# Altium project DISPLAY_EUA.PrjPcb
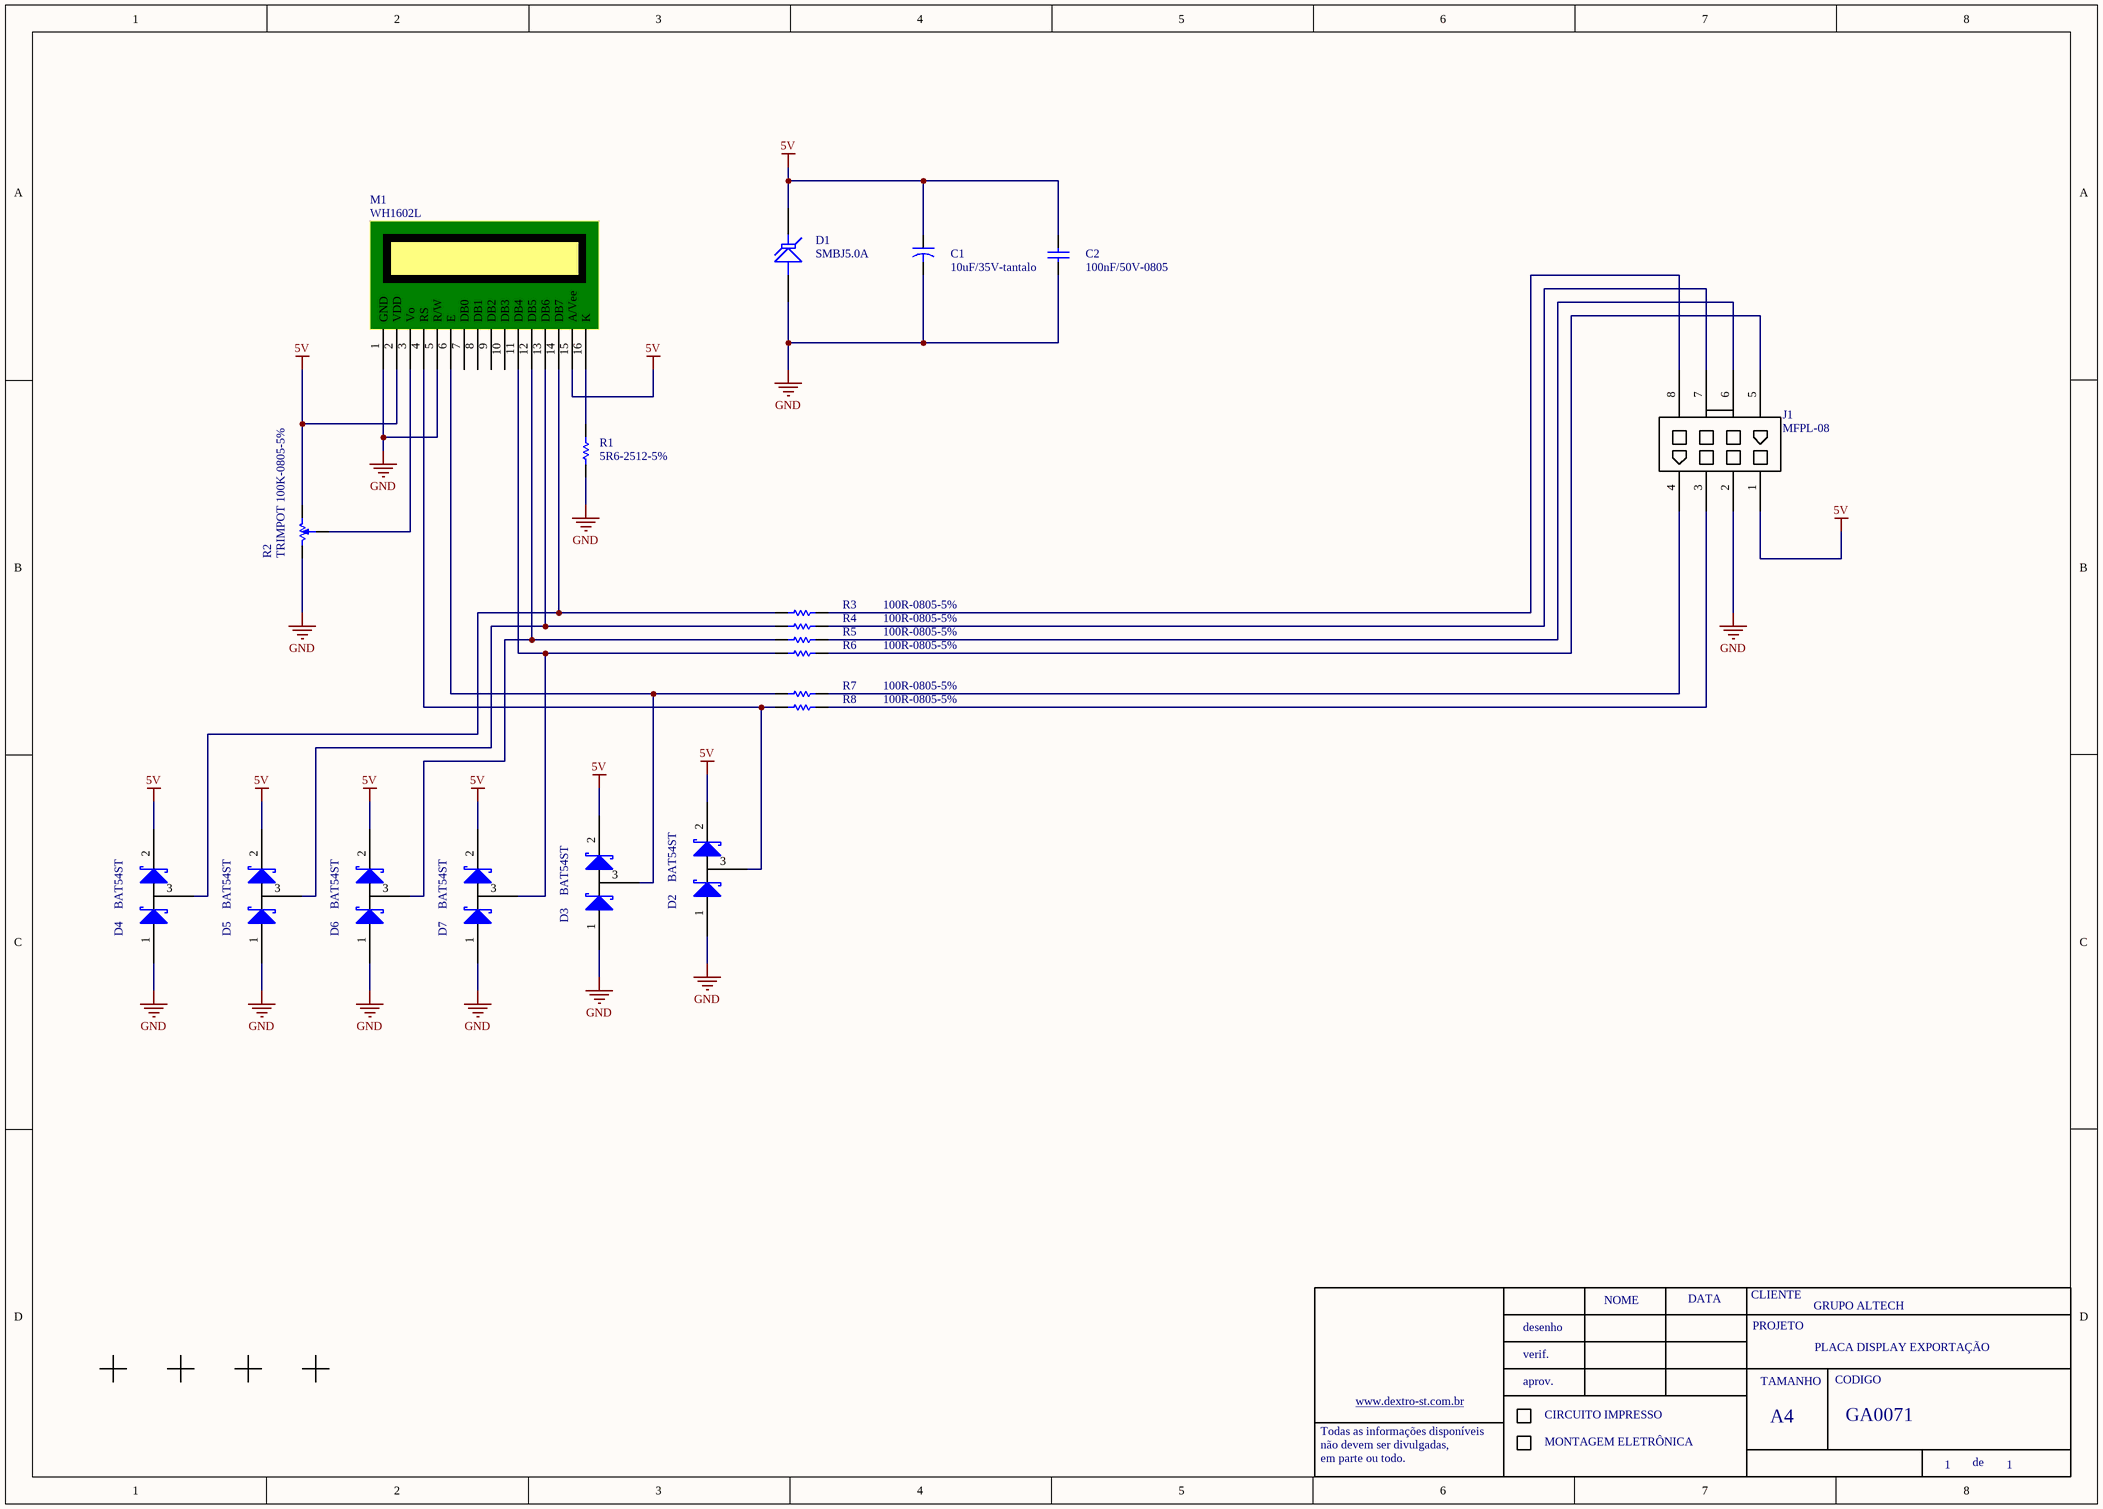
[diagram p0: Display_EUA.SchDoc]
1 sheet, 23 parts. Net scope: global (net labels, ports and power ports of the same name join across sheets).
Board files: DISPLAY_CE.PcbDoc, Painel_GA0071.PcbDoc

## Sheet Display_EUA.SchDoc: GRUPO ALTECH
size A3; DocumentNumber: GA0071; SheetNumber: 1; SheetTotal: 1

### Parts
C1  10uF/35V-tantalo  [tantalo vishay E]
C2  100nF/50V-0805  [0805-REVISADO ONDA]
D1  SMBJ5.0A  [DO-214AA]
D2  BAT54ST  [SOT23 - REVISADO ONDA]
D3  BAT54ST  [SOT23 - REVISADO ONDA]
D4  BAT54ST  [SOT23 - REVISADO ONDA]
D5  BAT54ST  [SOT23 - REVISADO ONDA]
D6  BAT54ST  [SOT23 - REVISADO ONDA]
D7  BAT54ST  [SOT23 - REVISADO ONDA]
FD1  FID  [FIDUCIAL CRUZ]  (value not drawn)
FD2  FID  [FIDUCIAL CRUZ]  (value not drawn)
FD3  FID  [FIDUCIAL CRUZ]  (value not drawn)
FD4  FID  [FIDUCIAL CRUZ]  (value not drawn)
J1  MFPL-08  [MFPC-08]
M1  WH1602L  [WH1602L1]
R1  5R6-2512-5%  [2512 - REVISADO ONDA]
R2  TRIMPOT 100K-0805-5%  [trimmer 3386]
R3  100R-0805-5%  [0805-REVISADO ONDA]
R4  100R-0805-5%  [0805-REVISADO ONDA]
R5  100R-0805-5%  [0805-REVISADO ONDA]
R6  100R-0805-5%  [0805-REVISADO ONDA]
R7  100R-0805-5%  [0805-REVISADO ONDA]
R8  100R-0805-5%  [0805-REVISADO ONDA]

### Nets
5V: C1.1 C2.2 D1.2(K) D2.2 D3.2 D4.2 D5.2 D6.2 D7.2 J1.1 M1.2(VDD) M1.15(A/Vee) R2.3
GND: C1.2 C2.1 D1.1(A) D2.1 D3.1 D4.1 D5.1 D6.1 D7.1 J1.2 M1.1(GND) M1.5(R/W) R1.1 R2.1
NetD2_3: D2.3 M1.4(RS) R8.1
NetD3_3: D3.3 M1.6(E) R7.1
NetD4_3: D4.3 M1.14(DB7) R3.1
NetD5_3: D5.3 M1.13(DB6) R4.1
NetD6_3: D6.3 M1.12(DB5) R5.1
NetD7_3: D7.3 M1.11(DB4) R6.1
NetJ1_3: J1.3 R8.2
NetJ1_4: J1.4 R7.2
NetJ1_5: J1.5 R6.2
NetJ1_6: J1.6 R5.2
NetJ1_7: J1.7 R4.2
NetJ1_8: J1.8 R3.2
NetM1_3: M1.3(Vo) R2.2
NetM1_16: M1.16(K) R1.2

Not connected (* = marked no-connect by the designer): M1 7(DB0) 8(DB1) 9(DB2) 10(DB3)

### Notes on the sheet
- PLACA DISPLAY EXPORTAÇÃO
- NOME
- DATA
- CLIENTE
- PROJETO
- desenho
- verif.
- aprov.
- TAMANHO
- CODIGO
- Todas as informações disponíveis
- não devem ser divulgadas,
- em parte ou todo.
- www.dextro-st.com.br
- CIRCUITO IMPRESSO
- MONTAGEM ELETRÔNICA
- A4
- de

### Library data of the parts
C2 = 100nF/50-0805-NPO: ERP: 104.11.005
FD1-FD4 = FIDUCIAL
R1 = 5R6-2512-1%: ERP: 102.31.013
R2 = TRIMPOT 10K-3386: ERP: 132.01.001
C1 = 10uF/35V-tantalo: ERP: 104.11.011
D1 = SMBJ5.0A: ERP: 128.02.002
R3-R8 = 100R-0805-5%: ERP: 102.11.031